# Altium schematic sheet Schematic_2.SchDoc
size A4
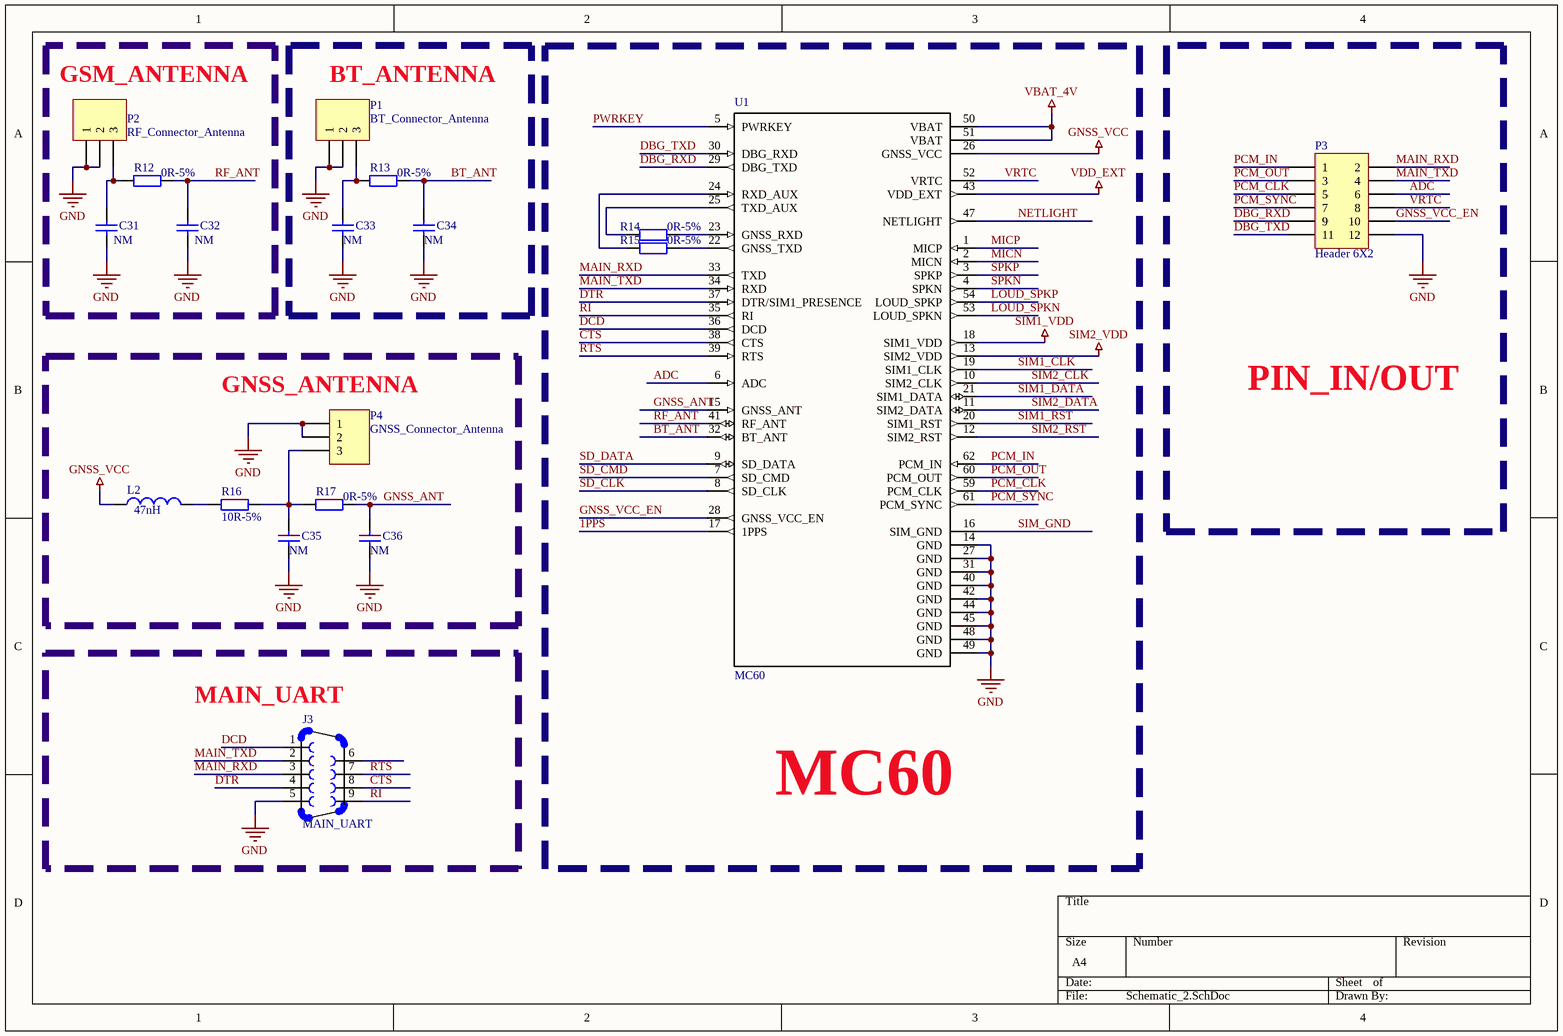
[diagram p0: Schematic_2.SchDoc]

## Parts
C31  value NM  [0402]  (hidden comment: Cap)
C32  value NM  [0402]  (hidden comment: Cap)
C33  value NM  [0402]  (hidden comment: Cap)
C34  value NM  [0402]  (hidden comment: Cap)
C35  value NM  [0402]  (hidden comment: Cap)
C36  value NM  [0402]  (hidden comment: Cap)
J3  MAIN_UART  [DB9_Female]
L2  value 47nH  [J1-0603]  (hidden comment: Inductor)
P1  BT_Connector_Antenna  [IPX_SMD_PCB_Plug]
P2  RF_Connector_Antenna  [IPX_SMD_PCB_Plug]
P3  Header 6X2  [Header 5x2]
P4  GNSS_Connector_Antenna  [IPX_SMD_PCB_Plug]
R12  value 0R-5%  [0402]  (hidden comment: Res2)
R13  value 0R-5%  [0402]  (hidden comment: Res2)
R14  value 0R-5%  [6-0805_L]  (hidden comment: Res2)
R15  value 0R-5%  [6-0805_L]  (hidden comment: Res2)
R16  value 10R-5%  [6-0805_L]  (hidden comment: Res2)
R17  value 0R-5%  [0402]  (hidden comment: Res2)
U1  MC60  [MC60_3D]

## Nets
GND: C31.1 C32.1 C33.1 C34.1 C35.1 C36.1 J3.5 P1.1 P1.2 P2.1 P2.2 P3.12 P4.1 P4.2 U1.14(GND) U1.27(GND) U1.31(GND) U1.40(GND) U1.42(GND) U1.44(GND) U1.45(GND) U1.48(GND) U1.49(GND)
GNSS_VCC: L2.1 U1.26(GNSS_VCC)
SIM1_VDD: U1.18(SIM1_VDD)
SIM2_VDD: U1.13(SIM2_VDD)
VBAT_4V: U1.50(VBAT) U1.51(VBAT)
VDD_EXT: U1.43(VDD_EXT)
1PPS: U1.17(1PPS)
ADC: P3.6 U1.6(ADC)
BT_ANT: C34.2 R13.2 U1.32(BT_ANT)
CTS: J3.8 U1.38(CTS)
DBG_RXD: P3.9 U1.29(DBG_TXD)
DBG_TXD: P3.11 U1.30(DBG_RXD)
DCD: J3.1 U1.36(DCD)
DTR: J3.4 U1.37(DTR/SIM1_PRESENCE)
GNSS_ANT: C36.2 R17.2 U1.15(GNSS_ANT)
GNSS_VCC_EN: P3.10 U1.28(GNSS_VCC_EN)
LOUD_SPKN: U1.53(LOUD_SPKN)
LOUD_SPKP: U1.54(LOUD_SPKP)
MAIN_RXD: J3.3 P3.2 U1.33(TXD)
MAIN_TXD: J3.2 P3.4 U1.34(RXD)
MICN: U1.2(MICN)
MICP: U1.1(MICP)
NETLIGHT: U1.47(NETLIGHT)
PCM_CLK: P3.5 U1.59(PCM_CLK)
PCM_IN: P3.1 U1.62(PCM_IN)
PCM_OUT: P3.3 U1.60(PCM_OUT)
PCM_SYNC: P3.7 U1.61(PCM_SYNC)
PWRKEY: U1.5(PWRKEY)
RF_ANT: C32.2 R12.2 U1.41(RF_ANT)
RI: J3.9 U1.35(RI)
RTS: J3.7 U1.39(RTS)
SD_CLK: U1.8(SD_CLK)
SD_CMD: U1.7(SD_CMD)
SD_DATA: U1.9(SD_DATA)
SIM1_CLK: U1.19(SIM1_CLK)
SIM1_DATA: U1.21(SIM1_DATA)
SIM1_RST: U1.20(SIM1_RST)
SIM2_CLK: U1.10(SIM2_CLK)
SIM2_DATA: U1.11(SIM2_DATA)
SIM2_RST: U1.12(SIM2_RST)
SIM_GND: U1.16(SIM_GND)
SPKN: U1.4(SPKN)
SPKP: U1.3(SPKP)
VRTC: P3.8 U1.52(VRTC)
NetC31_2: C31.2 P2.3 R12.1
NetC33_2: C33.2 P1.3 R13.1
NetC35_2: C35.2 P4.3 R16.2 R17.1
NetL2_2: L2.2 R16.1
NetR14_1: R14.1 U1.25(TXD_AUX)
NetR14_2: R14.2 U1.23(GNSS_RXD)
NetR15_1: R15.1 U1.24(RXD_AUX)
NetR15_2: R15.2 U1.22(GNSS_TXD)

Not connected (* = marked no-connect by the designer): J3 6

## Notes on the sheet
- (near P2) GSM_ANTENNA
- BT_ANTENNA
- (near P4) GNSS_ANTENNA
- PIN_IN/OUT
- (near J3) MAIN_UART
- MC60

## Library data of the parts
C31-C36 = Cap: Capacitor; Published: 8-Jun-2000; LatestRevisionDate: 17-Jul-2002; LatestRevisionNote: Re-released for DXP Platform.; PackageReference: RAD-0.3; Publisher: Altium Limited; PackageDescription: Radial Cap, Thru-Hole; 2 Leads; 0.3 in Pin Spacing
J3 = DB9: Tripp Lite DB9 Network In-Line Dataline Surge Protector 120V / 230V 9-PIN DB9; MF: Tripp Lite; SnapEDA_Link: https://www.snapeda.com/parts/DB9/Tripp%20Lite/view-part/?ref=snap; Package: None; Price: 18.04 USD; MP: DB9; Availability: Bad; Value: *
L2 = Inductor: Code_IEC: 1005; Published: 8-Jun-2000; LatestRevisionDate: 29-May-2009; LatestRevisionNote: IPC-7351 Footprint Added.; PackageReference: 0402-A; Publisher: Altium Limited; PackageDescription: Chip Inductor; Code_JEITA: 0402
P1 P2 P4 = Header 3: Header, 3-Pin; LatestRevisionDate: 17-Jul-2002; LatestRevisionNote: Re-released for DXP Platform.; Publisher: Altium Limited
P3 = Header 6X2: Header, 6-Pin, Dual row; LatestRevisionDate: 17-Jul-2002; LatestRevisionNote: Re-released for DXP Platform.; Publisher: Altium Limited
R12-R17 = Res2: Resistor; Published: 8-Jun-2000; LatestRevisionDate: 17-Jul-2002; LatestRevisionNote: Re-released for DXP Platform.; PackageReference: AXIAL-0.4; Publisher: Altium Limited; PackageDescription: Axial Device, Thru-Hole; 2 Leads; 0.4 in Pin Spacing
U1 = MC60: MC60 is a quad-band full-featured GSM/GPRS module using LCC castellation package. With an extensive set of internet protocols (TCP, UDP, PPP, FTP, HTTP and SSL*), it has integrated the GNSS technology for satellite navigation. Based on the latest 2G chipset, it has the optimal performance in SMS & data transmission as well as audio service even in harsh environments. It features Dual SIM Single Standby function.; MF: Quectel; Package: None; MP: MC60; Availability: Unavailable; SnapEDA_Link: https://www.snapeda.com/symbols-footprints/MC60/Quectel/view-part/?ref=snap; Price: None; Value: *